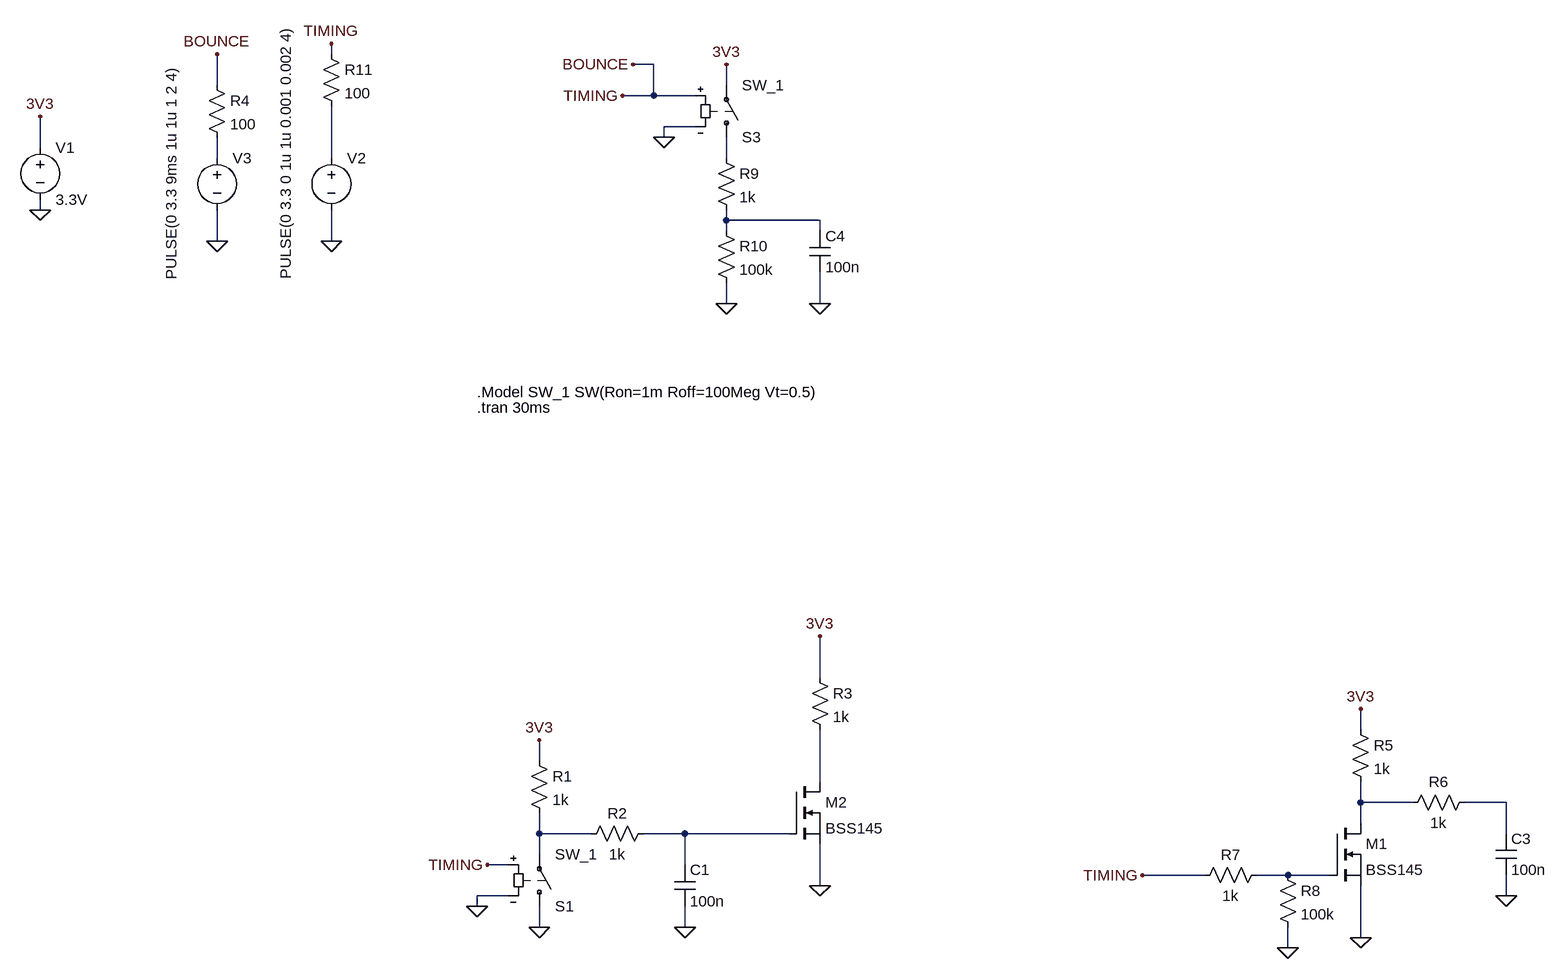
[diagram p0: schematic Debounce.asc]
Debounce.asc, the LTspice schematic file:
Version 4.1
SHEET 1 2120 1300
WIRE -576 -96 -576 -112
WIRE -80 -80 -112 -80
WIRE -752 -48 -752 -96
WIRE 32 -48 32 -80
WIRE -80 -32 -80 -80
WIRE -80 -32 -128 -32
WIRE -16 -32 -80 -32
WIRE -16 16 -64 16
WIRE -64 32 -64 16
WIRE -1024 48 -1024 0
WIRE -752 64 -752 32
WIRE -576 64 -576 -16
WIRE 32 64 32 32
WIRE -1024 144 -1024 128
WIRE 32 160 32 144
WIRE 176 160 32 160
WIRE 32 176 32 160
WIRE 176 176 176 160
WIRE -752 192 -752 144
WIRE -576 192 -576 144
WIRE 32 288 32 256
WIRE 176 288 176 240
WIRE 176 864 176 800
WIRE 1008 944 1008 912
WIRE -256 992 -256 960
WIRE 176 1024 176 944
WIRE 1008 1056 1008 1024
WIRE 1088 1056 1008 1056
WIRE 1232 1056 1168 1056
WIRE 1008 1088 1008 1056
WIRE -256 1104 -256 1072
WIRE -176 1104 -256 1104
WIRE -32 1104 -96 1104
WIRE 128 1104 -32 1104
WIRE 1232 1104 1232 1056
WIRE -256 1136 -256 1104
WIRE -304 1152 -336 1152
WIRE -32 1152 -32 1104
WIRE 768 1168 672 1168
WIRE 896 1168 848 1168
WIRE 960 1168 896 1168
WIRE 176 1184 176 1120
WIRE -304 1200 -352 1200
WIRE 1232 1200 1232 1168
WIRE -352 1216 -352 1200
WIRE -256 1248 -256 1216
WIRE -32 1248 -32 1216
WIRE 1008 1264 1008 1184
WIRE 896 1280 896 1248
FLAG -1024 0 3V3
FLAG -1024 144 0
FLAG -256 1248 0
FLAG -32 1248 0
FLAG -576 192 0
FLAG -576 -112 TIMING
FLAG -336 1152 TIMING
FLAG -352 1216 0
FLAG -256 960 3V3
FLAG 1008 1264 0
FLAG 1232 1200 0
FLAG 1008 912 3V3
FLAG 672 1168 TIMING
FLAG 896 1280 0
FLAG 176 1184 0
FLAG -128 -32 TIMING
FLAG -64 32 0
FLAG 32 288 0
FLAG 176 288 0
FLAG 32 -80 3V3
FLAG 176 800 3V3
FLAG -752 192 0
FLAG -752 -96 BOUNCE
FLAG -112 -80 BOUNCE
SYMBOL voltage -1024 32 R0
WINDOW 123 0 0 Left 0
WINDOW 39 0 0 Left 0
SYMATTR InstName V1
SYMATTR Value 3.3V
SYMBOL res -272 976 R0
SYMATTR InstName R1
SYMATTR Value 1k
SYMBOL res -80 1088 R90
WINDOW 0 0 56 VBottom 2
WINDOW 3 32 56 VTop 2
SYMATTR InstName R2
SYMATTR Value 1k
SYMBOL cap -48 1152 R0
SYMATTR InstName C1
SYMATTR Value 100n
SYMBOL sw -256 1232 M180
SYMATTR InstName S1
SYMATTR Value SW_1
SYMBOL voltage -576 48 R0
WINDOW 3 -70 203 VLeft 2
WINDOW 123 0 0 Left 0
WINDOW 39 0 0 Left 0
SYMATTR Value PULSE(0 3.3 0 1u 1u 0.001 0.002 4)
SYMATTR InstName V2
SYMBOL res 992 928 R0
SYMATTR InstName R5
SYMATTR Value 1k
SYMBOL res 1184 1040 R90
WINDOW 0 0 56 VBottom 2
WINDOW 3 32 56 VTop 2
SYMATTR InstName R6
SYMATTR Value 1k
SYMBOL cap 1216 1104 R0
SYMATTR InstName C3
SYMATTR Value 100n
SYMBOL nmos 960 1088 R0
SYMATTR InstName M1
SYMATTR Value BSS145
SYMBOL res 864 1152 R90
WINDOW 0 0 56 VBottom 2
WINDOW 3 32 56 VTop 2
SYMATTR InstName R7
SYMATTR Value 1k
SYMBOL res 880 1152 R0
SYMATTR InstName R8
SYMATTR Value 100k
SYMBOL nmos 128 1024 R0
SYMATTR InstName M2
SYMATTR Value BSS145
SYMBOL sw 32 48 M180
SYMATTR InstName S3
SYMATTR Value SW_1
SYMBOL res 16 48 R0
SYMATTR InstName R9
SYMATTR Value 1k
SYMBOL res 16 160 R0
SYMATTR InstName R10
SYMATTR Value 100k
SYMBOL cap 160 176 R0
SYMATTR InstName C4
SYMATTR Value 100n
SYMBOL res 160 848 R0
SYMATTR InstName R3
SYMATTR Value 1k
SYMBOL voltage -752 48 R0
WINDOW 3 -70 203 VLeft 2
WINDOW 123 0 0 Left 0
WINDOW 39 0 0 Left 0
SYMATTR Value PULSE(0 3.3 9ms 1u 1u 1 2 4)
SYMATTR InstName V3
SYMBOL res -768 -64 R0
SYMATTR InstName R4
SYMATTR Value 100
SYMBOL res -592 -112 R0
SYMATTR InstName R11
SYMATTR Value 100
TEXT -352 448 Left 2 !.tran 30ms
TEXT -352 424 Left 2 !.Model SW_1 SW(Ron=1m Roff=100Meg Vt=0.5)

The netlist it stands for:
* Debounce.asc
V1 3V3 0 3.3V
R1 3V3 N008 1k
R2 N009 N008 1k
C1 N009 0 100n
S1 0 N008 BOUNCE 0 SW_1
V2 N002 0 PULSE(0 3.3 0 1u 1u 0.001 0.002 4)
R5 3V3 N006 1k
R6 N007 N006 1k
C3 N007 0 100n
M1 N006 N010 0 0 BSS145
R7 N010 BOUNCE 1k
R8 N010 0 100k
M2 N005 N009 0 0 BSS145
S3 N003 3V3 BOUNCE 0 SW_1
R9 N003 N004 1k
R10 N004 0 100k
C4 N004 0 100n
R3 3V3 N005 1k
V3 N001 0 PULSE(0 3.3 9ms 1u 1u 1 2 4)
R4 BOUNCE N001 100
R11 BOUNCE N002 100
.model NMOS NMOS
.model PMOS PMOS
.lib standard.mos
.tran 30ms
.Model SW_1 SW(Ron=1m Roff=100Meg Vt=0.5)
.backanno
.end